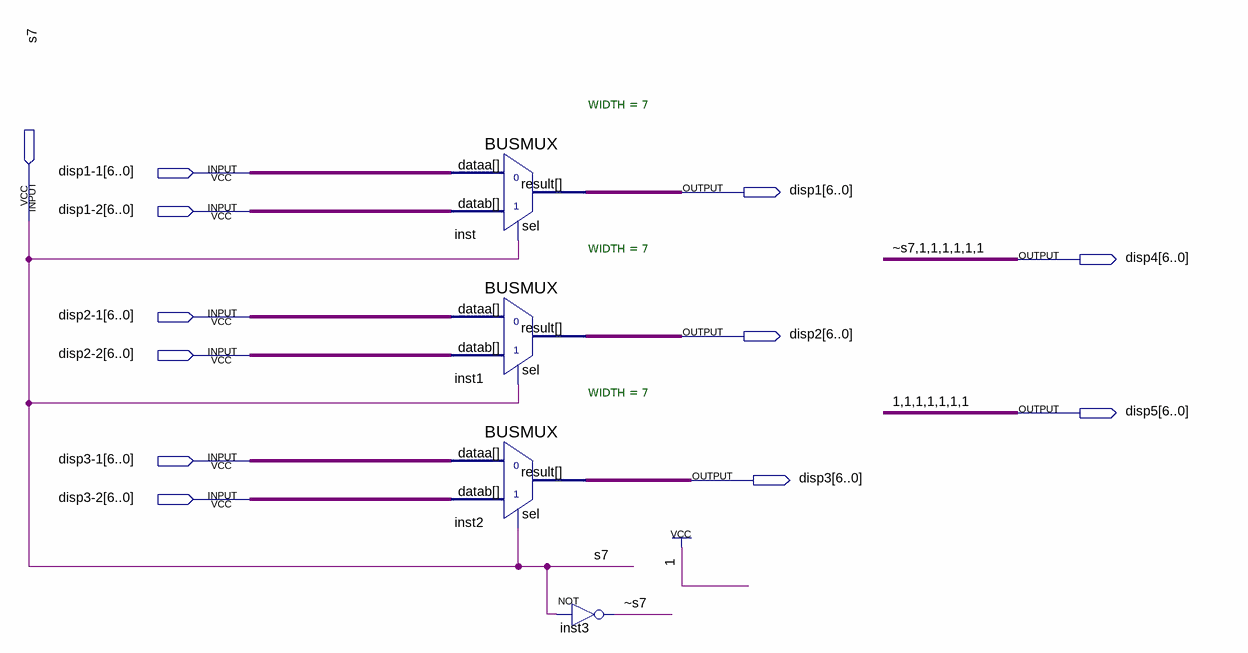
[diagram p0: schematic sheet]
// Quartus schematic nooverflowmux.bdf as structural Verilog: 4 symbols, 12 pins
module nooverflowmux (
  input  [6:0] \disp1-1 ,
  input  [6:0] \disp1-2 ,
  input  s7,
  input  [6:0] \disp2-1 ,
  input  [6:0] \disp2-2 ,
  input  [6:0] \disp3-1 ,
  input  [6:0] \disp3-2 ,
  output [6:0] disp1,
  output [6:0] disp4,
  output [6:0] disp2,
  output [6:0] disp5,
  output [6:0] disp3
);

  BUSMUX #(.WIDTH(7)) inst (.datab(\disp1-2 ), .sel(s7), .dataa(\disp1-1 ), .result(disp1));
  BUSMUX #(.WIDTH(7)) inst1 (.datab(\disp2-2 ), .sel(s7), .dataa(\disp2-1 ), .result(disp2));
  BUSMUX #(.WIDTH(7)) inst2 (.datab(\disp3-2 ), .sel(s7), .dataa(\disp3-1 ), .result(disp3));
  not inst3 (disp4[6], s7);

  assign disp4[5:0] = {6{1'b1}};
  assign disp5 = {7{1'b1}};

  // Other names for the same wires on the sheet: ~s7 = disp4[6]
endmodule
